# EAGLE design Adafruit Si471x PCB (EAGLE 6.3)
COMPANY: ADAFRUIT INDUSTRIES; DRAWN: KTOWN; REV: A
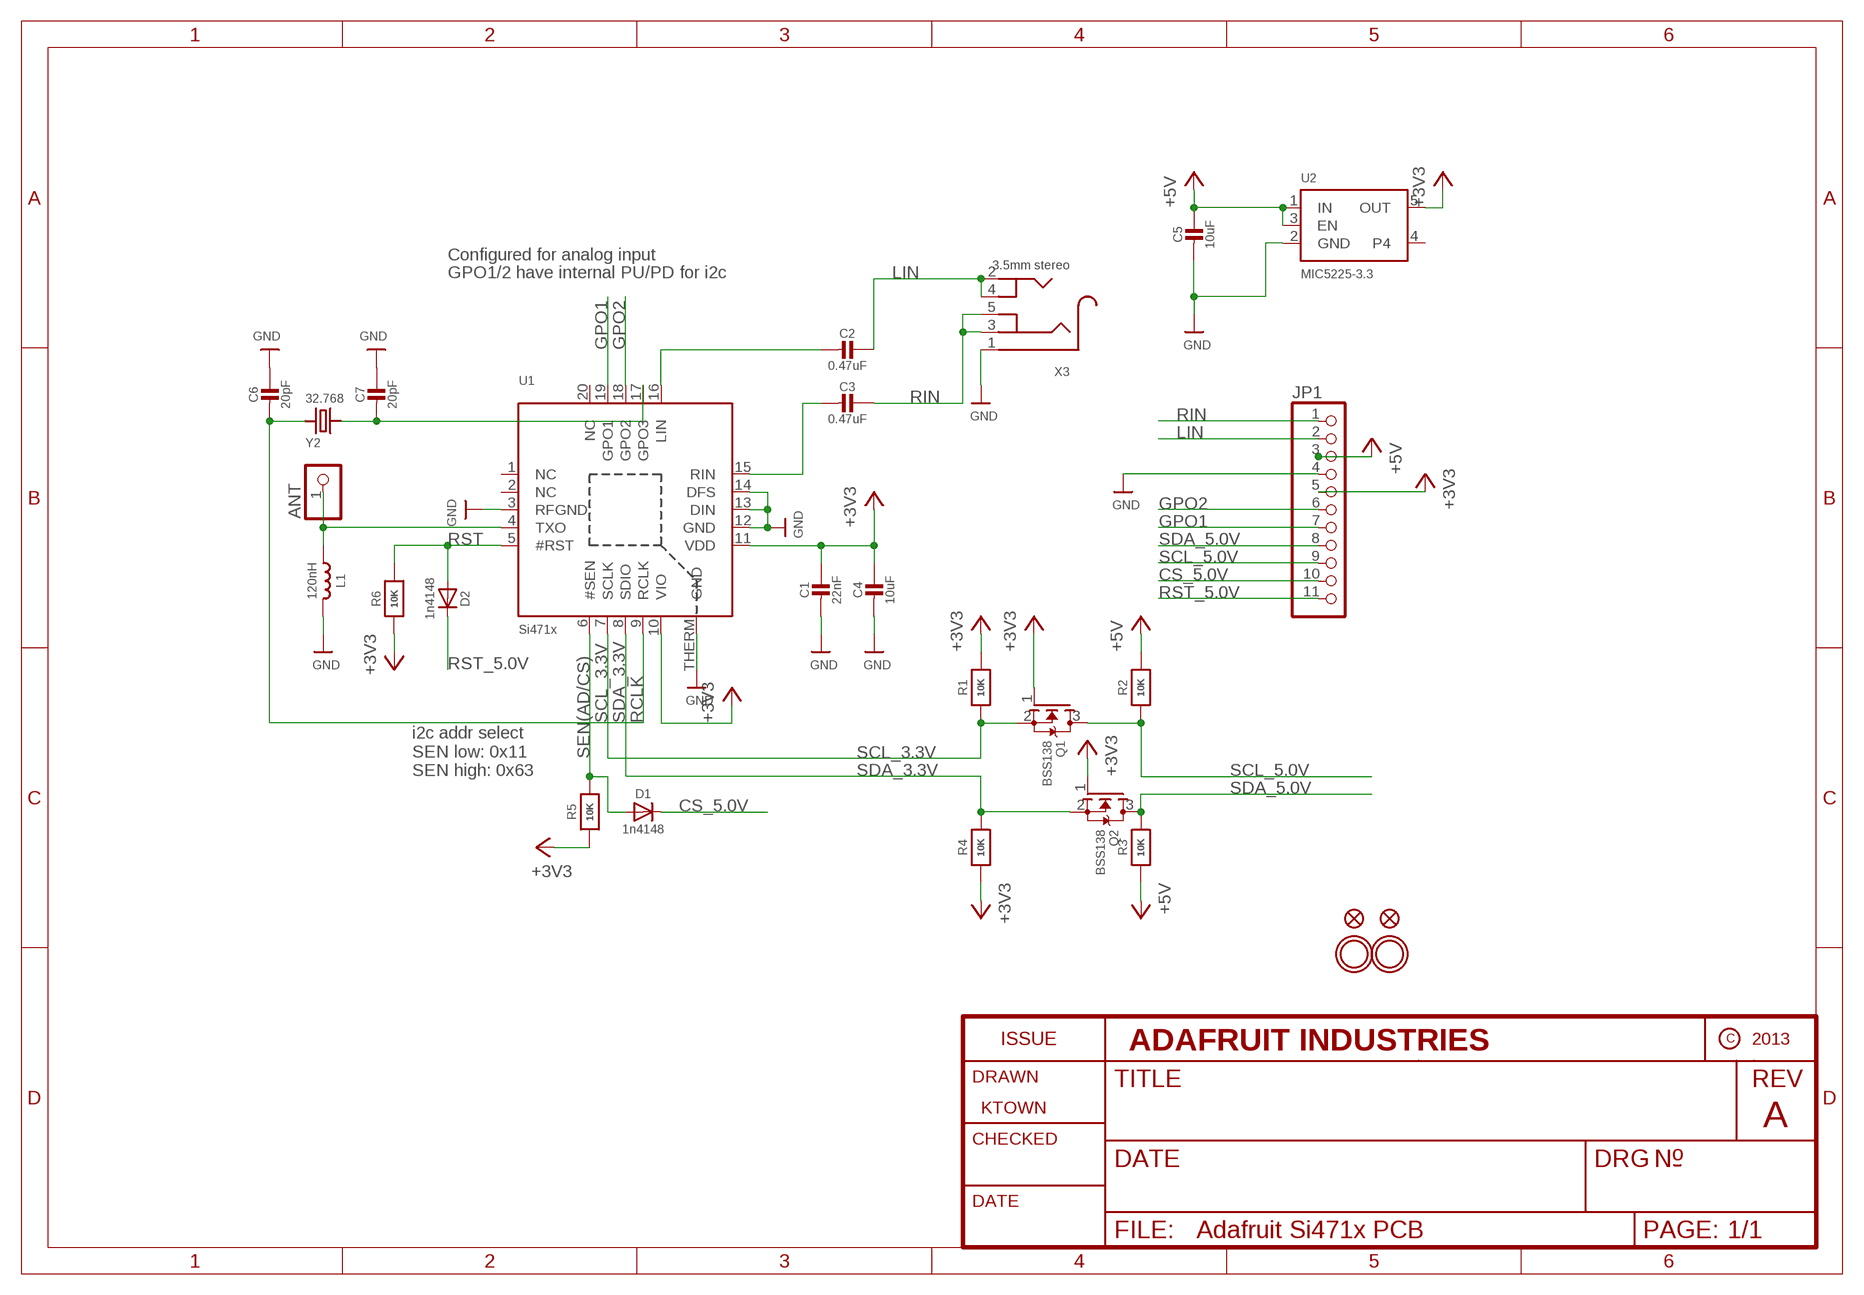
[diagram p0: schematic, sheet 1]

## Parts
ANT  PINHD-1X1  [1X01]
C1  22nF  CAP_CERAMIC0805-NOOUTLINE  [0805-NO]
C2  0.47uF  CAP_CERAMIC0805-NOOUTLINE  [0805-NO]
C3  0.47uF  CAP_CERAMIC0805-NOOUTLINE  [0805-NO]
C4  10uF  CAP_CERAMIC0805-NOOUTLINE  [0805-NO]
C5  10uF  CAP_CERAMIC0805-NOOUTLINE  [0805-NO]
C6  20pF  CAP_CERAMIC0805-NOOUTLINE  [0805-NO]
C7  20pF  CAP_CERAMIC0805-NOOUTLINE  [0805-NO]
D1  1n4148  DIODESOD-323  [SOD-323]
D2  1n4148  DIODESOD-323  [SOD-323]
FID1  FIDUCIAL""  [FIDUCIAL_1MM]
FID2  FIDUCIAL""  [FIDUCIAL_1MM]
JP1  HEADER-1X11  [1X11_ROUND]
L1  120nH  INDUCTOR_0805  [_0805]
Q1  BSS138  MOSFET-NREFLOW  [SOT23]
Q2  BSS138  MOSFET-NREFLOW  [SOT23]
R1  10K  RESISTOR0805_NOOUTLINE  [0805-NO]
R2  10K  RESISTOR_0805MP  [_0805MP]
R3  10K  RESISTOR0805_NOOUTLINE  [0805-NO]
R4  10K  RESISTOR_0805MP  [_0805MP]
R5  10K  RESISTOR0805_NOOUTLINE  [0805-NO]
R6  10K  RESISTOR0805_NOOUTLINE  [0805-NO]
U1  Si471x  SI471X  [SI471X]
U2  MIC5225-3.3  VREG_SOT23-5  [SOT23-5]
U$15  MOUNTINGHOLE2.5  [MOUNTINGHOLE_2.5_PLATED]
U$17  MOUNTINGHOLE2.5  [MOUNTINGHOLE_2.5_PLATED]
X3  3.5mm stereo  AUDIO_3.5MMJACK  [4UCONN_19269]
Y2  32.768  CRYSTAL8.0X3.8  [CRYSTAL_8X3.8]

## Nets
+3V3: C1.1 C4.1 JP1.5 Q1.1(G) Q2.1(G) R1.2 R4.1 R5.1 R6.1 U1.10(VIO) U1.11(VDD) U2.5(OUT)
+5V: C5.1 JP1.3 R2.2 R3.1 U2.1(IN) U2.3(EN)
CS_5.0V: D1.C JP1.10
GND: C1.2 C4.2 C5.2 C6.1 C7.1 JP1.4 L1.2 U1.3(RFGND) U1.12(GND) U1.13(DIN) U1.14(DFS) U1.THERM(GND) U2.2(GND) X3.1
GPO1: JP1.7 U1.19(GPO1)
GPO2: JP1.6 U1.18(GPO2)
LIN: C2.1 JP1.2 X3.2 X3.4
N$1: ANT.1 L1.1 U1.4(TXO)
N$3: C2.2 U1.16(LIN)
N$4: C3.2 U1.15(RIN)
N$6: C7.2 U1.17(GPO3) Y2.P$4
RCLK: C6.2 U1.9(RCLK) Y2.P$1
RIN: C3.1 JP1.1 X3.3 X3.5
RST: D2.A R6.2 U1.5(#RST)
RST_5.0V: D2.C JP1.11
SCL_3.3V: Q1.2(S) R1.1 U1.7(SCLK)
SCL_5.0V: JP1.9 Q1.3(D) R2.1
SDA_3.3V: Q2.2(S) R4.2 U1.8(SDIO)
SDA_5.0V: JP1.8 Q2.3(D) R3.2
SEN(AD/CS): D1.A R5.2 U1.6(#SEN)
Unconnected: U1.1(NC) U1.2(NC) U1.20(NC) U2.4

## Notes on the sheet
- Configured for analog input
- GPO1/2 have internal PU/PD for i2c
- i2c addr select
  SEN low: 0x11
  SEN high: 0x63

## Library data of the parts
ANT = adafruit:PINHD-1X1: Pin header 1x1 for 0.1" spacing With round pins
C1-C7 = microbuilder:CAP_CERAMIC: Ceramic Capacitors For new designs, use the packages preceded by an '_' character since they are more reliable: The following footprints should be used on most boards: _0402 - Standard footprint for regular board layouts _0603 - Standard footprint for regular board layouts _0805 - Standard footprint for regular board layouts _1206 - Standard footprint for regular board layouts For extremely tight-pitch boards where space is at a premium, the following 'micro-pitch' footprints can be used (smaller pads, no silkscreen outline, etc.): _0402MP - Micro-pitch footprint for very dense/compact boards _0603MP - Micro-pitch footprint for very dense/compact boards _0805MP - Micro-pitch footprint for very dense/compact boards _1206MP - Micro-pitch footprint for very dense/compact boards
D1 D2 = microbuilder:DIODE: Diode SMA Model Volts Amps Type Vf Ir Digikey # Notes SSA34-E3 40V 3A Schottky 480mV @ 3A 200uA @ 40V SSA34-E3/61TGITR-ND CDBA120-G 20V 1A Schottky 500mV @ 1A 500uA @ 20V 641-1014-6-ND REEL MBRA210 10V 2A Schottky 350mV @ 2A 700uA @ 10V MBRA210LT3 SOD-123 Model Volts Amps Type Vf Ir Order # Notes BAT54T1G 30V 200mA Schottky 800mV @ 200mA 2uA @ 25V BAT54T1GOSTR-ND B0530W 30V 500mA Schottky 430mV @ 500mA 130uA @ 30V B0530W-FDICT-ND REEL MBR120 20V 1A Schottky 340mV @ 1A MBR120VLSFT1GOSCT-ND SOD-323 Model Volts Amps Type Vf Ir Order # Notes PMEG2005EJ 20V 500mA Schottky 355mV @ 500mA 568-4110-1-ND ZLLS410 10V 570mA Schottky 380mV @ 570mA ZLLS410CT-ND 1N4148WS 75V 150mA Silicon/Simple 1V 1N4148WSFSCT-ND REEL SOD-523 Model Volts Amps Type Vf Ir Order # Notes BAT54XV2 30V 200mA Schottky 0.8V @ 100mA BAT54XV2CT-ND TB751S 30V 30mA Schottky RB751S-40TE61CT-ND SOT23-R/W (R = Solder Paste/Reflow Ovens, W = Hand-Soldering) Model Volts Amps Type Vf Ir Order # Notes BAT54FILM 40V 300mA Schottky 497-7162-1-ND POWERDI-5 Model Volts Amps Type Vf Ir Order # Notes PDS560 60V 5A Schottky 670mV @ 5A 150uA @ 60V PDS560DICT-ND
FID1 FID2 = microbuilder:FIDUCIAL: Fiducial Alignment Points Various fiducial points for machine vision alignment.; BOM: EXCLUDE
JP1 = microbuilder:HEADER-1X11
L1 = microbuilder:INDUCTOR: Inductors 0603: 10nH Ceramic Inductor - microwire antenna/RF (Digikey: 712-1434-2-ND) 0805: 560nH Ceramic Inductor - RF (Digikey: 553-1047-1-ND) 270nH Ceramic Inductor - Q = 40@250MHz, +-5%, 1 Ohm DC Resistance (Digikey: 535-10506-2-ND) 1007 (2518 Metric) SMT: 10µH 10% 250mOhm 820mA 1007 Inductor (Digikey: 587-2189-1-ND) 22µH 10% 500mOhm 580mA 1007 Inductor (Digikey: 587-2190-1-ND) 47µH 10% 950mOhm 420mA 1007 Inductor (Digikey: 587-2191-1-ND) 47µH 5% 100mOhm 1A 1008 Inductor (Digikey: 732-1816-1-ND) 5.0x5.0mm (Taiyo Yuden NR5040 Series) 6.8µH 20% 2.3A 64mOhm Inductor (Digikey: 587-2374-2-ND) 5.0x5.0mm (TDK VLC5045 Series) 4.7µH 20% 3.3A 34mOhm Inductor (Digikey: 445-6526-1-ND) 6.8µH 20% 2.7A 46mOhm Inductor (Digikey: 445-6527-1-ND) 6.0x6.0mm (TDK VLC6045 Series) 4.7µH 20% 3.8A 27mOhm Inductor (Digikey: 445-6538-2-ND) 6.8µH 20% 3A 41mOhm Inductor (Digikey: 445-6540-1-ND) 6.2µH 30% 2.2A 45mOhm Inductor (Digikey: SRR5028-6R2YCT-ND) - Not TDK VLC6045 but footprint should match 6.0x6.0mm (TDK SLF6045 Series) 6.8uH 30% 2A 33mOhm Inductor (Digikey: 445-4572-1-ND, Mouser: 810-SLF645T6R8N2R0PF) 6.0x6.0mm (Sumida CDRH5D28 Series) 6.2uH 30% 1.8A 45mOhm Inductor (Digikey: 308-1542-1-ND) Taiyo Yuden NR3015T2R2M - 2.2uH 20% 1.5A (Digikey: 587-1648-2-ND, Mouser: 963-NR3015T2R2M) - Used with TI TPS62172 CoilCraft RFID Transponder Coil - MA5532-AE (For use with AS3935 Lightning Sensor)
Q1 Q2 = adafruit:MOSFET-N: N-Channel Mosfet 2N7002E - 60V 260mA SOT23 [Digikey: 2N7002ET1GOSTR-ND] - REEL BSH103 - 30V 850mA SOT23 [Digikey: 568-5013-1-ND]
R1-R6 = microbuilder:RESISTOR: Resistors For new designs, use the packages preceded by an '_' character since they are more reliable: The following footprints should be used on most boards: _0402 - Standard footprint for regular board layouts _0603 - Standard footprint for regular board layouts _0805 - Standard footprint for regular board layouts _1206 - Standard footprint for regular board layouts For extremely tight-pitch boards where space is at a premium, the following 'micro-pitch' footprints can be used (smaller pads, no silkscreen outline, etc.): _0402MP - Micro-pitch footprint for very dense/compact boards _0603MP - Micro-pitch footprint for very dense/compact boards _0805MP - Micro-pitch footprint for very dense/compact boards _1206MP - Micro-pitch footprint for very dense/compact boards
U1 = microbuilder:SI471X: Si4712/13 FM Radio Transmitter and Receiver VDD: 2.7-5.5V FM Band: 76-108MHz
U2 = microbuilder:VREG_SOT23-5: SOT23-5 Fixed Voltage Regulators Part Current Out V Out V In V Dropout θJA (°C/W) TJ (°C) Digikey Part No. ADP121 150mA 3.3V 3.4-5.5V 0.09V @ 150mA -- -- ADP121-AUJZ33R7CT-ND ADP121 150mA 3.0V 3.1-5.5V 0.09V @ 150mA -- -- ADP121-AUJZ30R7CT-ND ADP122 300mA 3.3V 3.4-5.5V 0.085V @ 300mA -- -- ADP122AUJZ-3.3-R7CT-ND ADP1712 300mA 3.3V 3.5-5.5V 0.17V @ 300mA -- -- ADP1712AUJZ-3.3-R7TR-ND AP7311 (Low Cost) 150mA 3.3V 3.5-6V 0.15V @ 150mA -- -- AP7311-33WG-7DICT-ND LD39015M18R 150mA 1.8V 1.9V-5.5V 0.08V @ 100mA -- -- 497-6977-1-ND LP2985A-33DBVR 150mA 3.3V 3.3-16V 0.28V @ 150mA 206 150 296-18479-1-ND MCP1824T-3302E/OT 300mA 3.3V 3.5V-6V 0.2V @ 300mA -- -- MCP1824T-3302E/OTCT-ND MIC5205-2.5YM5 TR 150mA 2.5V 2.7-16V 0.165V @ 150mA -- -- 576-1257-2-ND MIC5205-3.0YM5 TR 150mA 3.0V 3.2V-16V 0.165V @ 150mA -- -- 576-1258-2-ND MIC5205-3.3YM5 TR 150mA 3.3V 3.5V-16V 0.165V @ 150mA -- -- 576-1259-2-ND TPS780330220 150mA 3.3V+2.2V 3.6-5.5V 250mV Max -- -- 296-23332-1-ND TDA3663/N1,135 100mA 3.3V 3.5-45V 0.18V @ 50mA -- -- 568-5343-1-ND Max operating temp can be calculated using θJA, TJ (max junction temperature), and power in watts. Set the "Maximum Ambient Temperature" until it reaches TJ ("Max Junction Temperature"), which is the absolute limit for safe use of the regulator: Heat Sink Temperature Calculator <http://www.daycounter.com/Calculators/Heat-Sink-Temperature-Calculator.phtml> For example, With 12V source into a 3.3V LP2985 and a 30mA load, we are dissipating (12V-3.3V) * 0.03A = 0.261W. With a θJA of 206 °C/W, a TJ of 150°C, and 261mW we can safely use the chip without a heat sink up to 75°C (=147.1°C Junction Temperature).
U$15 U$17 = microbuilder:MOUNTINGHOLE: Mounting Hole For #2 screws (0.086"/2.18mm width, 0.094"/2.4mm hole) use 2.5mm; BOM: EXCLUDE
X3 = microbuilder:AUDIO_3.5MMJACK: 3.5MM Audio Jack These are normally connected as follows, from left-to right on the schematic symbol above: Tip: Left Audio Inner Ring: Right Audio Shell: Common/GND
Y2 = microbuilder:CRYSTAL: Crystals HC49UP - Surface Mount Crystal 4.0MHz 18pF +/-30ppm Surface Mount Crystal [Digikey: 535-9857-1-ND] 12.0 MHz Surface Mount Crystal [Digikey: 535-9869-6-ND] 25.0 MHz Surface Mount Crystal [Digikey: 535-9078-1-ND] 2.5 x 2.0mm - MEMs SMT Crystal 16.0 MHz 10pF 20ppm 2.5 x 2.0mm Crystal [Digikey -40-85°C: 535-10923-1-ND] 3.2 x 2.5mm - MEMs SMT Crystal 12.0 MHz 8pF 15ppm 3.2 x 2.5mm Crystal [Digikey: -10-70°C: 644-1047-1-ND -40-125°C: 644-1128-1-ND] 40~85°C cheaper: 644-1173-6-ND 16.0 MHz 8pF 15ppm 3.2 x 2.5mm Crystal [Digikey: -10-70°C: 644-1049-1-ND -40-125°C: 644-1129-2-ND]-40~85°C cheaper: 644-1175-6-ND 16.0 MHz 10pF 10ppm 3.2 x 2.5mm Crystal [Digikey: 644-1100-1-ND] 27.12 MHz 18pF 30ppm 3.2 x 2.5mm Crystal [Digikey: 887-1424-1-ND] 27.12MHz 10pF 10ppm 3.2 x 2.5mm Crystal [Digikey: 887-1329-1-ND] 4.9 x 1.8mm - MEMs SMT Crystal 32.768 KHz 12.5pF 20ppm 4.9 x 1.8mm Crystal [Digikey: SE2415CT-ND] 8.0 x 3.8mm - Surface Mount Crystal 32.768kHz 12.5pF 20ppm -40°C-85°C [Digikey: 535-9166-2-ND] Cylinder 32.768KHz Cylinder Crystal (2x6mm body) [Ex. Digikey: 300-8341-2-ND]

## Board
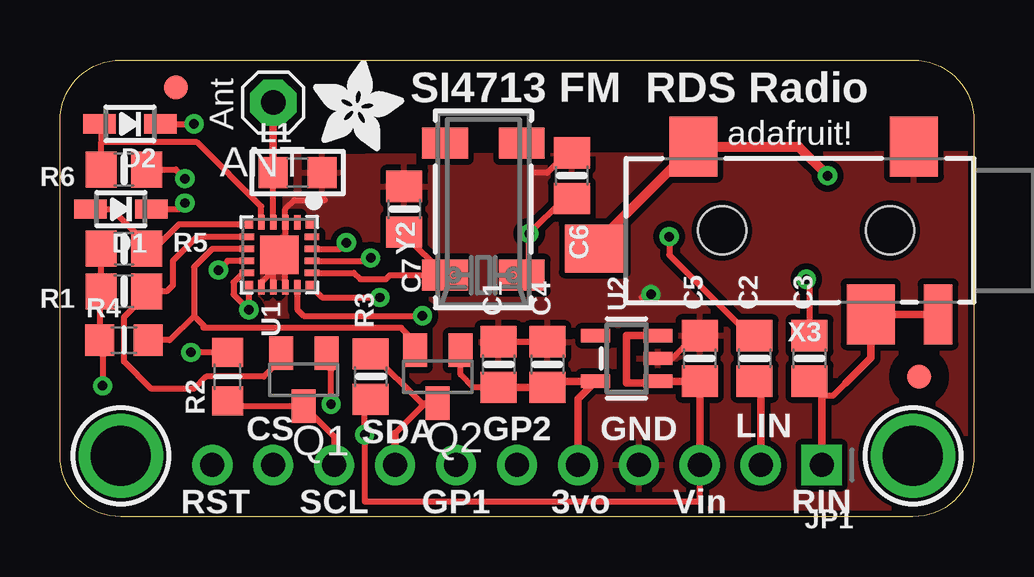
[diagram p1: board, top side]
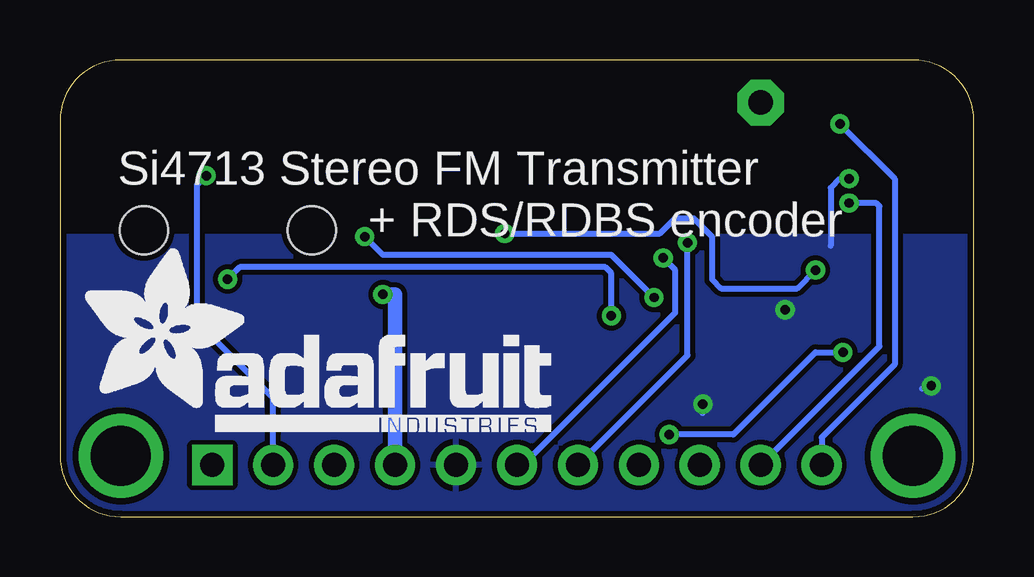
[diagram p2: board, bottom side, seen from below]

Size 38.1 x 19.05 mm. Coordinates in mm from the lower left corner, seen from the top.
Outline: 38.1,16.51 38.1,2.54 arc-90 35.56,0 2.54,0 arc-90 0,2.54 0,16.51 arc-90 2.54,19.05 35.56,19.05 arc-90 38.1,16.51
Copper layers (1*16): Top 0.035mm / dielectric 1.5mm / Bottom 0.035mm
Design rules "adafruit *": minimum track width 8mil, minimum drill 15.5mil, track to track 8mil, track to pad 8mil, pad to pad 8mil, via to via 8mil, smd to smd 8mil, copper to edge 10mil, drill to drill 8mil, minimum pad ring 10mil, minimum via ring 8mil, stop-mask expansion 2mil, vias tented up to drill 20mil, thermal gap 10mil
tRestrict: area 8.6,9.3 to 8.7,9.6; area 9.1,9.3 to 9.2,9.6; area 7.7,9.9 to 8,10

### Footprints (pad centres in the part's own frame; a part is rotated, then mirrored left to right if it is on the bottom)
1X01 = drill 1.016 pad 1.93 octagon: 1 0,0
0805-NO = smd 1.3 x 1.5: 1 -0.95,0; 2 0.95,0
SOD-323 = smd 1.35 x 0.8: A 1.27,0; C -1.27,0
FIDUCIAL_1MM = smd 1 x 1: 1 0,0
1X11_ROUND = drill 1 pad 1.676 square: 1 -12.7,0 | drill 1 pad 1.676: 2 -10.16,0; 3 -7.62,0; 4 -5.08,0; 5 -2.54,0; 6 0,0; 7 2.54,0; 8 5.08,0; 9 7.62,0; 10 10.16,0; 11 12.7,0
_0805 = smd 1.2 x 1.3: 1 -1.016,0; 2 1.016,0
SOT23 = smd 1 x 1.4: 1 -0.95,-1.1; 2 0.95,-1.1; 3 0,1.1
_0805MP = smd 1.2 x 1.3: 1 -1.016,0; 2 1.016,0
SI471X = smd 0.34 x 0.34: 1 -1.265,1.265; 6 -1.265,-1.265; 11 1.265,-1.265; 16 1.265,1.265 | smd 0.61 x 0.28: 2 -1.355,0.75; 3 -1.355,0.25; 4 -1.355,-0.25; 5 -1.355,-0.75; 12 1.355,-0.75; 13 1.355,-0.25; 14 1.355,0.25; 15 1.355,0.75 | smd 0.28 x 0.61: 7 -0.75,-1.355; 8 -0.25,-1.355; 9 0.25,-1.355; 10 0.75,-1.355; 17 0.75,1.355; 18 0.25,1.355; 19 -0.25,1.355; 20 -0.75,1.355 | smd 1.6 x 1.6: THERM 0,0
SOT23-5 = smd 0.55 x 1.2: 1 -0.95,-1.3; 2 0,-1.3; 3 0.95,-1.3; 4 0.95,1.3; 5 -0.95,1.3
MOUNTINGHOLE_2.5_PLATED = drill 2.5 pad 3.2: P$1 0,0
4UCONN_19269 = smd 2 x 2.5: 1 2.5,-3.5; 2 11.7,-3.5; 3 4.3,3.5 | smd 2.5 x 2: 4 15.8,0.75 | smd 1.2 x 2.5: 5 1.5,3.5 | hole 2: 3.5,0; 10.5,0
CRYSTAL_8X3.8 = smd 1.3 x 1.9: P$1 -2.75,-1.6; P$2 2.75,-1.6; P$3 2.75,1.6; P$4 -2.75,1.6

### Placement (x,y rotation side)
ANT  8.89,17.27 180 top
C1  18.29,6.35 90 top
C2  28.96,6.6 90 top
C3  31.24,6.6 90 top
C4  20.32,6.35 90 top
C5  26.67,6.6 90 top
C6  21.34,14.22 270 top
C7  14.35,12.83 270 top
D1  2.54,12.83 180 top
D2  2.92,16.38 180 top
FID1  4.83,17.91 180 top
FID2  35.81,5.84 180 top
JP1  19.05,2.16 180 top
L1  9.91,14.35 0 top
Q1  10.16,5.71 180 top
Q2  15.75,5.84 180 top
R1  2.67,9.4 180 top
R2  6.99,5.84 90 top
R3  12.95,5.84 90 top
R4  2.67,7.37 0 top
R5  2.67,11.18 0 top
R6  2.67,14.48 180 top
U1  9.14,10.92 270 top
U2  23.62,6.6 90 top
U$7  [ADAFRUIT_3.5MM]  10.54,15.24 0 top
U$9  [ADAFRUIT_TEXT_20MM]  37.21,3.56 0 bottom
U$15  35.56,2.54 180 top
U$17  2.54,2.54 180 top
X3  38.1,11.94 180 top
Y2  17.65,12.83 90 top

### Tracks (layer width: path | path; a pad name or v marks a point on that pad's centre or on a via)
+3V3  (via drill 0.39)
  Top 0.254: C1.1 17.22,5.4 16.7,5.93 Q2.1 | R5.1 R1.2 1.65,9.33 R4.1 1.71,7.3 1.78,7.3 v1.78,5.46 | U1.10 7.63,10.17 7.24,9.78 7.24,9.27 v7.87,8.64 U1.11 | v11.3,4.7 11.3,6.11 11.11,6.31 Q1.1 | 4.95,14.35 v5.21,14.1 4.83,14.48 R6.1
  Top 0.305: JP1.5 21.59,4.92 U2.5 20.57,5.65 C4.1 C1.1
  Bottom 0.254: v11.3,4.7 11.3,4.32 | v1.78,5.46 2.03,5.46 2.16,5.33 | v5.21,14.1 5.59,14.1 5.97,13.72 5.97,11.3
  pour Bottom: 37.85,-0.13 37.85,11.68 -0.13,11.68 -0.13,-0.13
+5V  (via drill 0.39)
  Top 0.254: R3.1 12.7,4.64 v12.7,3.43 12.7,0.64 26.67,0.64 JP1.3 | R2.2 v5.46,6.86
  Top 0.305: JP1.3 C5.1 U2.1 24.92,5.59 23.62,5.59 23.62,7.55 U2.3
  Bottom 0.254: v12.7,3.43 10.03,3.43 6.6,6.86 v5.46,6.86
CS_5.0V  (via drill 0.39)
  Top 0.254: D1.C 4.95,12.83 v5.21,13.08
  Bottom 0.254: JP1.10 3.94,7.11 3.94,12.95 4.06,13.08 v5.21,13.08
GND  (via drill 0.39)
  Top 0.254: U1.13 8.89,10.29 | 8.89,10.29 8.89,10.67 U1.THERM | U1.14 9.39,10.67 U1.THERM | C5.2 26.48,7.55 25.53,6.6 U2.2 | U1.THERM 9.39,10.92 U1.3 9.39,12.82 9.78,13.21 11.05,13.21 10.92,13.34 | C1.2 C4.2 20.32,7.49 | v24.64,9.27 24.64,9.14 24.26,9.14 | 8.38,9.78 U1.12 8.39,9.77 8.38,9.78 | 9.14,10.79 U1.THERM | C6.1 21.14,15.17 20.32,14.35 19.68,14.35 | 8.38,9.78 8.89,10.29
  Bottom 0.61: JP1.4 24.13,9.27 v24.64,9.27
  pour Top (isolate 0.254): 0.13,-0.13 38.23,-0.13 38.23,15.14 0,14.96
GPO1  (via drill 0.39)
  Top 0.254: U1.19 11.68,11.17 v11.94,11.43
  Bottom 0.254: JP1.7 11.94,6.73 v11.94,11.43
GPO2  (via drill 0.39)
  Top 0.254: U1.18 12.83,10.67 v12.95,10.79
  Bottom 0.254: v12.95,10.79 12.45,10.29 12.45,8.51 18.8,2.16 JP1.6
LIN  (via drill 0.39)
  Top 0.305: JP1.2 29.21,5.4
  Top 0.406: v32,14.22 30.79,15.44 X3.2 22.3,11.34 X3.4 | C2.1 29.21,5.4
  Bottom 0.254: JP1.2 29.21,4.95 32.38,8.13 32.38,13.84 v32,14.22
N$1
  Top 0.254: U1.4 L1.1
  Top 0.305: L1.1 ANT.1
N$3  (via drill 0.39)
  Top 0.254: v25.4,11.68 25.4,10.92 28.77,7.55 C2.2 | U1.16 10.92,9.14 v13.34,9.14
  Bottom 0.254: v13.34,9.14 15.11,10.92 24.64,10.92 v25.4,11.68
N$4  (via drill 0.39)
  Top 0.254: U1.15 9.89,8.65 10.16,8.38 v15.11,8.38 | v31.11,9.91 31.24,9.78 C3.2
  Bottom 0.254: v15.11,8.38 15.11,10.16 15.37,10.41 30.61,10.41 v31.11,9.91
N$6
  Top 0.254: U1.17 12.25,10.17 12.51,9.91 13.59,9.91 13.76,10.08 Y2.P$4 14.35,11.78 C7.2
RCLK  (via drill 0.39)
  Top 0.254: U1.9 6.99,10.67 v6.6,10.29 | v19.56,11.81 19.36,12.01 | C6.2 21.02,13.27 v19.56,11.81 | Y2.P$1 19.56,10.38 v19.56,11.81
  Bottom 0.254: v19.56,11.81 13.08,11.81 12.45,12.45 11.68,12.45 10.92,11.68 10.92,9.91 10.54,9.53 7.37,9.53 v6.6,10.29
RIN
  Top 0.254: C3.1 31.24,5.55 31.75,5.05 32.22,5.05 32.77,5.59
  Top 0.305: X3.5 X3.3 33.8,6.62 32.77,5.59 | JP1.1 31.75,5.05
RST
  Top 0.254: U1.5 8.39,12.94 5.71,15.62 1.72,15.62 | 1.72,15.62 1.72,16.38 D2.A | R6.2 1.72,15.62
RST_5.0V  (via drill 0.39)
  Top 0.254: D2.C v5.59,16.38
  Bottom 0.254: 6.35,2.41 JP1.11 6.35,3.3 3.3,6.35 3.3,14.1 v5.59,16.38
SCL_3.3V
  Top 0.254: U1.7 5.7,11.67 4.7,10.67 4.7,9.65 4.45,9.4 R1.1 3.62,9.27 2.67,8.32 2.67,6.48 3.81,5.33 5.59,5.33 6.1,5.84 8.51,5.84 9.21,6.54 Q1.2
SCL_5.0V
  Top 0.254: R2.1 7.2,4.62 Q1.3 11.43,3.35 JP1.9
  Top 0.305: JP1.9 11.43,2.58
SDA_3.3V
  Top 0.254: U1.8 6.35,11.17 5.59,10.41 5.59,8.38 | 6.1,7.87 14.22,7.87 14.8,7.3 Q2.2 | 6.1,7.87 5.97,7.87 | 5.59,8.38 6.1,7.87 | 5.59,8.38 4.57,7.37 R4.2
SDA_5.0V
  Top 0.254: R3.2 13.02,6.79 15.07,4.74 Q2.3 15.24,4.74 13.97,3.47
  Top 0.305: JP1.8 13.97,3.47
SEN(AD/CS)
  Top 0.254: 3.68,11.18 R5.2 | R5.2 3.17,11.62 3.17,11.81 2.16,12.83 D1.A | U1.6 4.95,12.19 4.19,11.43 3.87,11.43 R5.2

### Text on the board
tPlace: SI4713 FM RDS Radio | Ant | adafruit! | CS | SDA | GP2 | GND | LIN | RST | SCL | GP1 | 3vo | Vin | RIN
bPlace: Si4713 Stereo FM Transmitter | + RDS/RDBS encoder